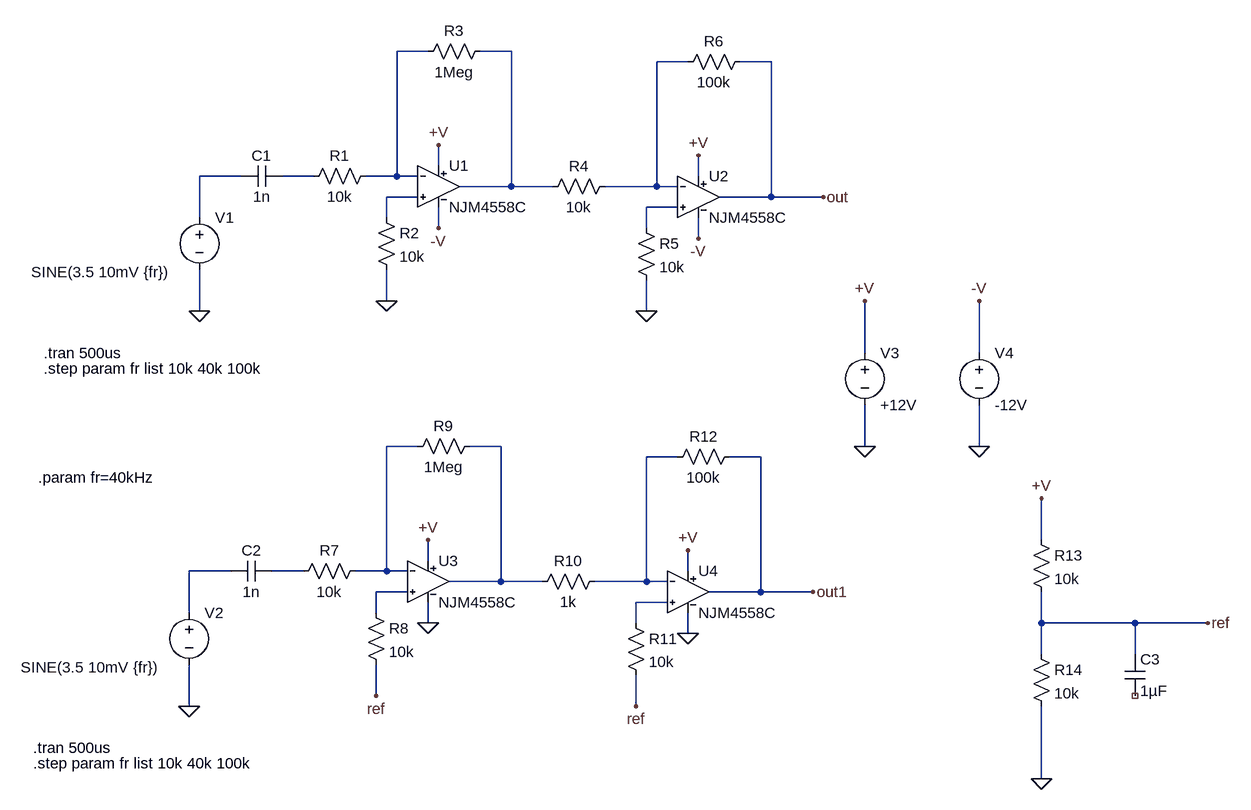
[diagram p0: schematic Draft4.asc]
Draft4.asc, the LTspice schematic file:
Version 4
SHEET 1 1936 944
WIRE 688 -224 640 -224
WIRE 816 -224 768 -224
WIRE 1088 -208 1040 -208
WIRE 1216 -208 1168 -208
WIRE 704 -48 704 -80
WIRE 400 -32 336 -32
WIRE 512 -32 464 -32
WIRE 640 -32 640 -224
WIRE 640 -32 592 -32
WIRE 672 -32 640 -32
WIRE 1104 -32 1104 -64
WIRE 816 -16 816 -224
WIRE 816 -16 736 -16
WIRE 880 -16 816 -16
WIRE 1040 -16 1040 -208
WIRE 1040 -16 960 -16
WIRE 1072 -16 1040 -16
WIRE 672 0 624 0
WIRE 1216 0 1216 -208
WIRE 1216 0 1136 0
WIRE 1296 0 1216 0
WIRE 1072 16 1024 16
WIRE 336 32 336 -32
WIRE 624 32 624 0
WIRE 704 48 704 16
WIRE 1024 48 1024 16
WIRE 1104 64 1104 32
WIRE 624 160 624 112
WIRE 336 176 336 112
WIRE 1024 176 1024 128
WIRE 1360 240 1360 160
WIRE 1536 240 1536 160
WIRE 672 384 624 384
WIRE 800 384 752 384
WIRE 1360 384 1360 320
WIRE 1536 384 1536 320
WIRE 1072 400 1024 400
WIRE 1200 400 1152 400
WIRE 1632 528 1632 464
WIRE 688 560 688 528
WIRE 384 576 320 576
WIRE 496 576 448 576
WIRE 624 576 624 384
WIRE 624 576 576 576
WIRE 656 576 624 576
WIRE 1088 576 1088 544
WIRE 800 592 800 384
WIRE 800 592 720 592
WIRE 864 592 800 592
WIRE 1024 592 1024 400
WIRE 1024 592 944 592
WIRE 1056 592 1024 592
WIRE 656 608 608 608
WIRE 1200 608 1200 400
WIRE 1200 608 1120 608
WIRE 1280 608 1200 608
WIRE 1056 624 1008 624
WIRE 320 640 320 576
WIRE 608 640 608 608
WIRE 688 656 688 624
WIRE 1008 656 1008 624
WIRE 1632 656 1632 608
WIRE 1776 656 1632 656
WIRE 1888 656 1776 656
WIRE 1088 672 1088 640
WIRE 1632 704 1632 656
WIRE 1776 704 1776 656
WIRE 608 768 608 720
WIRE 320 784 320 720
WIRE 1008 784 1008 736
WIRE 1632 896 1632 784
FLAG 336 176 0
FLAG 704 -80 +V
FLAG 704 48 -V
FLAG 624 160 0
FLAG 1104 -64 +V
FLAG 1104 64 -V
FLAG 1024 176 0
FLAG 1296 0 out
FLAG 320 784 0
FLAG 688 528 +V
FLAG 1088 544 +V
FLAG 1280 608 out1
FLAG 688 656 0
FLAG 1088 672 0
FLAG 1360 160 +V
FLAG 1360 384 0
FLAG 608 768 ref
FLAG 1008 784 ref
FLAG 1536 160 -V
FLAG 1536 384 0
FLAG 1632 464 +V
FLAG 1632 896 0
FLAG 1888 656 ref
SYMBOL NJM4558C 704 -80 R0
SYMATTR InstName U1
SYMBOL voltage 336 16 R0
WINDOW 3 -259 100 Left 2
WINDOW 123 0 0 Left 0
WINDOW 39 0 0 Left 0
SYMATTR InstName V1
SYMATTR Value SINE(3.5 10mV {fr})
SYMBOL cap 464 -48 R90
WINDOW 0 0 32 VBottom 2
WINDOW 3 32 32 VTop 2
SYMATTR InstName C1
SYMATTR Value 1n
SYMBOL res 608 -48 R90
WINDOW 0 0 56 VBottom 2
WINDOW 3 32 56 VTop 2
SYMATTR InstName R1
SYMATTR Value 10k
SYMBOL res 608 16 R0
SYMATTR InstName R2
SYMATTR Value 10k
SYMBOL res 784 -240 R90
WINDOW 0 0 56 VBottom 2
WINDOW 3 32 56 VTop 2
SYMATTR InstName R3
SYMATTR Value 1Meg
SYMBOL res 976 -32 R90
WINDOW 0 0 56 VBottom 2
WINDOW 3 32 56 VTop 2
SYMATTR InstName R4
SYMATTR Value 10k
SYMBOL NJM4558C 1104 -64 R0
SYMATTR InstName U2
SYMBOL res 1008 32 R0
SYMATTR InstName R5
SYMATTR Value 10k
SYMBOL res 1184 -224 R90
WINDOW 0 0 56 VBottom 2
WINDOW 3 32 56 VTop 2
SYMATTR InstName R6
SYMATTR Value 100k
SYMBOL NJM4558C 688 528 R0
SYMATTR InstName U3
SYMBOL voltage 320 624 R0
WINDOW 3 -259 100 Left 2
WINDOW 123 0 0 Left 0
WINDOW 39 0 0 Left 0
SYMATTR InstName V2
SYMATTR Value SINE(3.5 10mV {fr})
SYMBOL cap 448 560 R90
WINDOW 0 0 32 VBottom 2
WINDOW 3 32 32 VTop 2
SYMATTR InstName C2
SYMATTR Value 1n
SYMBOL res 592 560 R90
WINDOW 0 0 56 VBottom 2
WINDOW 3 32 56 VTop 2
SYMATTR InstName R7
SYMATTR Value 10k
SYMBOL res 592 624 R0
SYMATTR InstName R8
SYMATTR Value 10k
SYMBOL res 768 368 R90
WINDOW 0 0 56 VBottom 2
WINDOW 3 32 56 VTop 2
SYMATTR InstName R9
SYMATTR Value 1Meg
SYMBOL res 960 576 R90
WINDOW 0 0 56 VBottom 2
WINDOW 3 32 56 VTop 2
SYMATTR InstName R10
SYMATTR Value 1k
SYMBOL NJM4558C 1088 544 R0
SYMATTR InstName U4
SYMBOL res 992 640 R0
SYMATTR InstName R11
SYMATTR Value 10k
SYMBOL res 1168 384 R90
WINDOW 0 0 56 VBottom 2
WINDOW 3 32 56 VTop 2
SYMATTR InstName R12
SYMATTR Value 100k
SYMBOL voltage 1360 224 R0
SYMATTR InstName V3
SYMATTR Value +12V
SYMBOL voltage 1536 224 R0
SYMATTR InstName V4
SYMATTR Value -12V
SYMBOL res 1616 512 R0
SYMATTR InstName R13
SYMATTR Value 10k
SYMBOL res 1616 688 R0
SYMATTR InstName R14
SYMATTR Value 10k
SYMBOL cap 1760 704 R0
SYMATTR InstName C3
SYMATTR Value 1µF
TEXT 96 240 Left 2 !.tran 500us
TEXT 96 264 Left 2 !.step param fr list 10k 40k 100k
TEXT 80 848 Left 2 !.tran 500us
TEXT 80 872 Left 2 !.step param fr list 10k 40k 100k
TEXT 88 432 Left 2 !.param fr=40kHz

The netlist it stands for:
* Draft4.asc
XU1 N006 N001 +V -V N002 NJM4558C  ; pins In+ In- V+ V- OUT
V1 N004 0 SINE(3.5 10mV {fr})
C1 N005 N004 1n
R1 N001 N005 10k
R2 N006 0 10k
R3 N002 N001 1Meg
R4 N003 N002 10k
XU2 N007 N003 +V -V out NJM4558C  ; pins In+ In- V+ V- OUT
R5 N007 0 10k
R6 out N003 100k
XU3 N013 N008 +V 0 N009 NJM4558C  ; pins In+ In- V+ V- OUT
V2 N011 0 SINE(3.5 10mV {fr})
C2 N012 N011 1n
R7 N008 N012 10k
R8 N013 ref 10k
R9 N009 N008 1Meg
R10 N010 N009 1k
XU4 N014 N010 +V 0 out1 NJM4558C  ; pins In+ In- V+ V- OUT
R11 N014 ref 10k
R12 out1 N010 100k
V3 +V 0 +12V
V4 -V 0 -12V
R13 +V ref 10k
R14 ref 0 10k
C3 ref NC_01 1µF
.tran 500us
.step param fr list 10k 40k 100k
.tran 500us
.step param fr list 10k 40k 100k
.param fr=40kHz
.backanno
.end